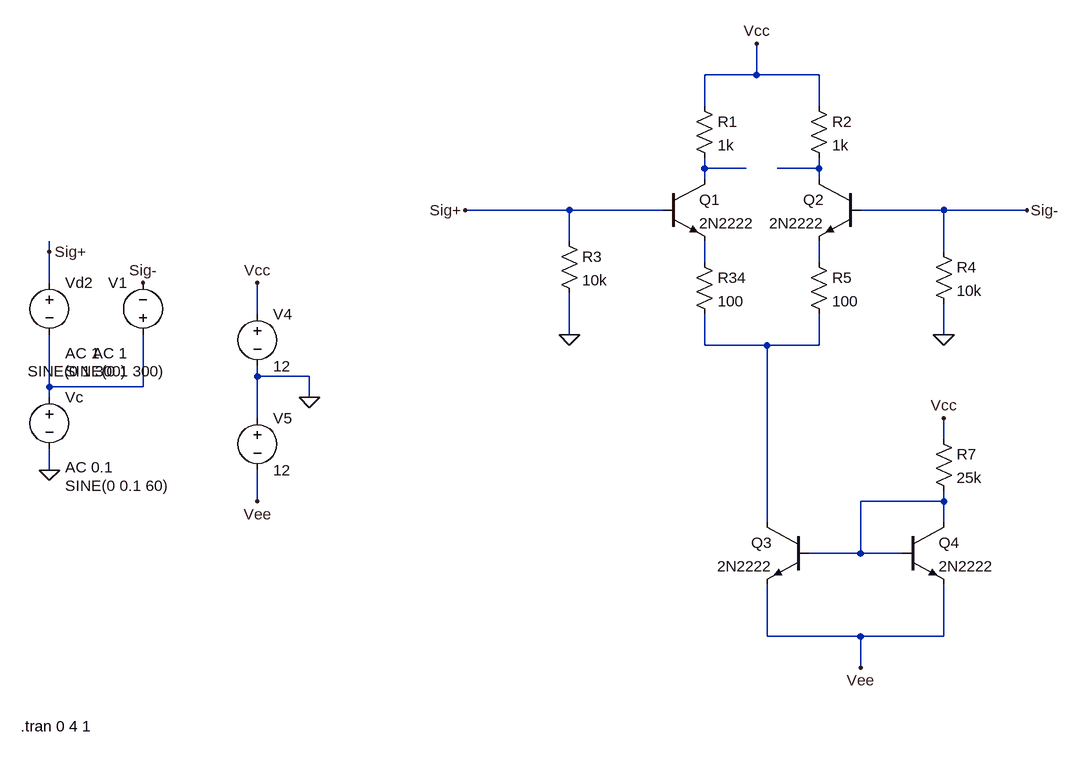
[diagram p0: schematic Draft2.asc]
Draft2.asc, the LTspice schematic file:
Version 4
SHEET 1 880 1004
WIRE 64 -16 64 -64
WIRE 64 -16 -16 -16
WIRE 160 -16 64 -16
WIRE -16 32 -16 -16
WIRE 160 32 160 -16
WIRE -16 128 -16 112
WIRE 48 128 -16 128
WIRE 160 128 160 112
WIRE 160 128 96 128
WIRE -16 144 -16 128
WIRE 160 144 160 128
WIRE -224 192 -384 192
WIRE -80 192 -224 192
WIRE 352 192 224 192
WIRE 480 192 352 192
WIRE -224 240 -224 192
WIRE -1024 256 -1024 240
WIRE 352 256 352 192
WIRE -16 272 -16 240
WIRE 160 272 160 240
WIRE -1024 304 -1024 256
WIRE -704 352 -704 304
WIRE -224 384 -224 320
WIRE 352 384 352 336
WIRE -16 400 -16 352
WIRE 80 400 -16 400
WIRE 160 400 160 352
WIRE 160 400 80 400
WIRE -704 448 -704 432
WIRE -624 448 -704 448
WIRE -1024 464 -1024 384
WIRE -880 464 -880 384
WIRE -880 464 -1024 464
WIRE -1024 480 -1024 464
WIRE -624 480 -624 448
WIRE -704 512 -704 448
WIRE 352 544 352 512
WIRE -1024 592 -1024 560
WIRE -704 640 -704 592
WIRE 352 640 352 624
WIRE 352 640 224 640
WIRE 80 672 80 400
WIRE 352 672 352 640
WIRE 224 720 224 640
WIRE 224 720 144 720
WIRE 288 720 224 720
WIRE 80 848 80 768
WIRE 224 848 80 848
WIRE 352 848 352 768
WIRE 352 848 224 848
WIRE 224 896 224 848
FLAG 352 384 0
FLAG -224 384 0
FLAG -1024 592 0
FLAG -624 480 0
FLAG -704 304 Vcc
FLAG -704 640 Vee
FLAG 224 896 Vee
FLAG 352 512 Vcc
FLAG 64 -64 Vcc
FLAG -1024 256 Sig+
FLAG -384 192 Sig+
FLAG 480 192 Sig-
FLAG -880 304 Sig-
SYMBOL res -32 16 R0
SYMATTR InstName R1
SYMATTR Value 1k
SYMBOL res 144 16 R0
SYMATTR InstName R2
SYMATTR Value 1k
SYMBOL res -240 224 R0
SYMATTR InstName R3
SYMATTR Value 10k
SYMBOL res 336 240 R0
SYMATTR InstName R4
SYMATTR Value 10k
SYMBOL res 144 256 R0
SYMATTR InstName R5
SYMATTR Value 100
SYMBOL res -32 256 R0
SYMATTR InstName R34
SYMATTR Value 100
SYMBOL res 336 528 R0
SYMATTR InstName R7
SYMATTR Value 25k
SYMBOL npn -80 144 R0
SYMATTR InstName Q1
SYMATTR Value 2N2222
SYMBOL npn 224 144 M0
SYMATTR InstName Q2
SYMATTR Value 2N2222
SYMBOL npn 144 672 M0
SYMATTR InstName Q3
SYMATTR Value 2N2222
SYMBOL npn 288 672 R0
SYMATTR InstName Q4
SYMATTR Value 2N2222
SYMBOL voltage -1024 464 R0
WINDOW 3 24 152 Left 2
WINDOW 123 24 124 Left 2
WINDOW 39 0 0 Left 0
SYMATTR InstName Vc
SYMATTR Value SINE(0 0.1 60)
SYMATTR Value2 AC 0.1
SYMBOL voltage -1024 288 R0
WINDOW 3 24 152 Left 2
WINDOW 123 24 124 Left 2
WINDOW 39 0 0 Left 0
SYMATTR InstName Vd2
SYMATTR Value SINE(0 1 300)
SYMATTR Value2 AC 1
SYMBOL voltage -704 336 R0
WINDOW 123 0 0 Left 0
WINDOW 39 0 0 Left 0
SYMATTR InstName V4
SYMATTR Value 12
SYMBOL voltage -704 496 R0
SYMATTR InstName V5
SYMATTR Value 12
SYMBOL voltage -880 400 R180
WINDOW 0 24 96 Left 2
WINDOW 3 24 -40 Left 2
WINDOW 123 24 -12 Left 2
WINDOW 39 0 0 Left 0
SYMATTR InstName V1
SYMATTR Value SINE(0 1 300)
SYMATTR Value2 AC 1
TEXT -1068 986 Left 2 !.tran 0 4 1

The netlist it stands for:
* Draft2.asc
R1 Vcc N001 1k
R2 Vcc N002 1k
R3 Sig+ 0 10k
R4 Sig- 0 10k
R5 N004 N005 100
R34 N003 N005 100
R7 Vcc N007 25k
Q1 N001 Sig+ N003 0 2N2222
Q2 N002 Sig- N004 0 2N2222
Q3 N005 N007 Vee 0 2N2222
Q4 N007 N007 Vee 0 2N2222
Vc N006 0 SINE(0 0.1 60) AC 0.1
Vd2 Sig+ N006 SINE(0 1 300) AC 1
V4 Vcc 0 12
V5 0 Vee 12
V1 N006 Sig- SINE(0 1 300) AC 1
.model NPN NPN
.model PNP PNP
.lib standard.bjt
.tran 0 4 1
.backanno
.end